# Altium schematic sheet StuctureReceiver.SchDoc: Структурна схема передавача аудіосигналів
size A2; Author: Neuimin; CompanyName: KPI; Organization: KPI; Address3: Kyiv; Address4: Ukraine
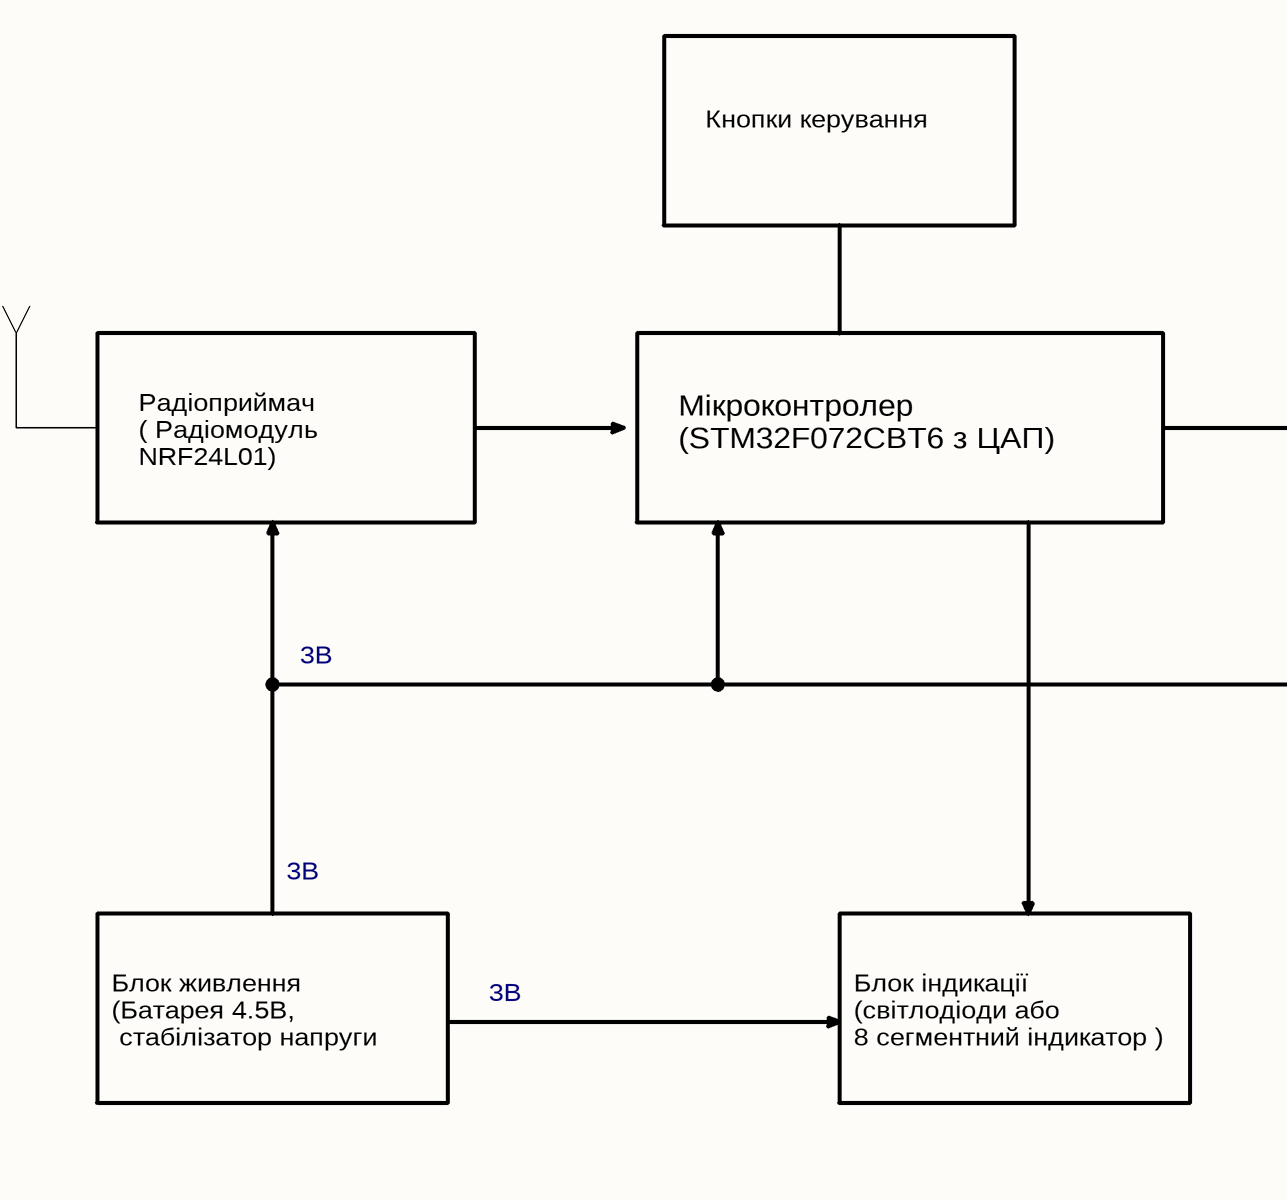
[diagram p0: StuctureReceiver.SchDoc, left]
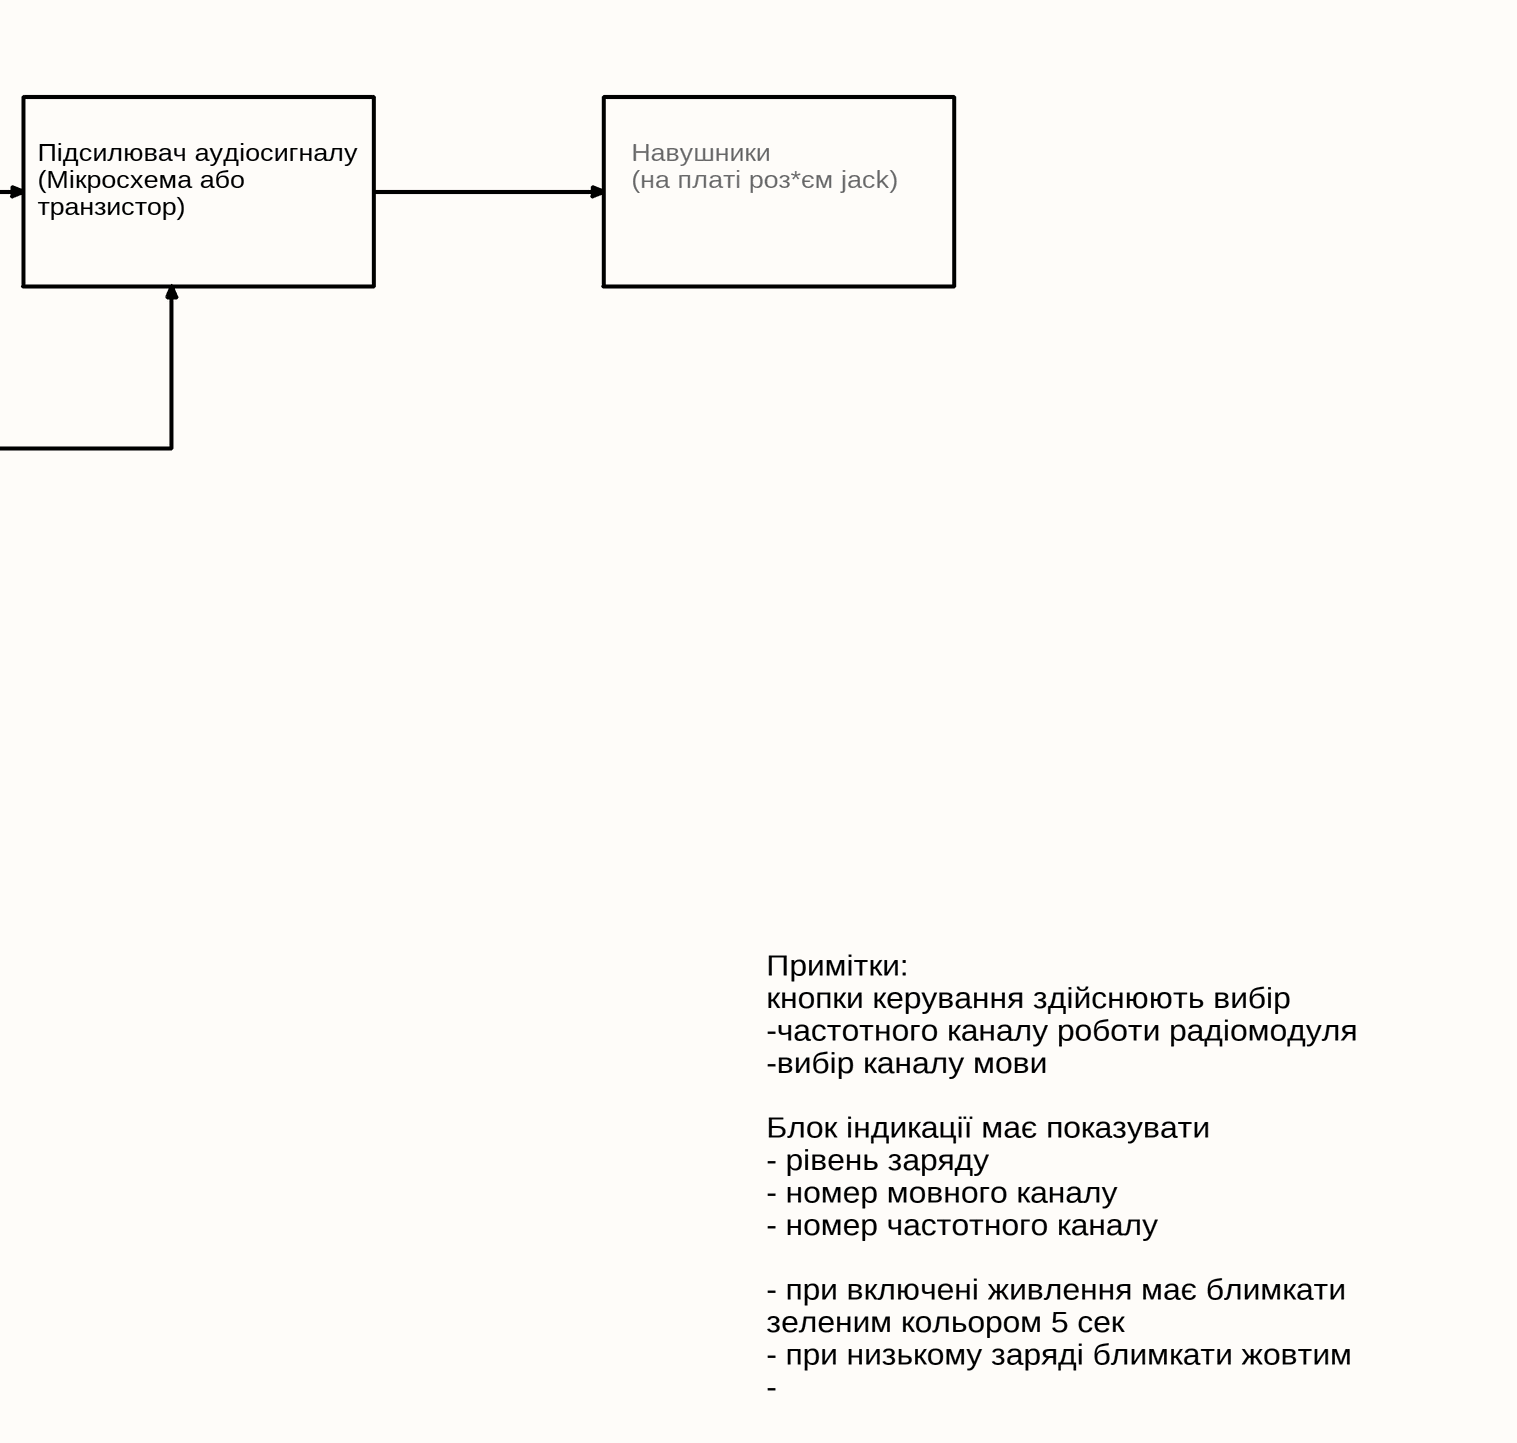
[diagram p1: StuctureReceiver.SchDoc, right]

## Notes on the sheet
- Кнопки керування
- Радіоприймач
  ( Радіомодуль NRF24L01)
- Мікроконтролер
  (STM32F072CBT6 з ЦАП)
- Підсилювач аудіосигналу
  (Mікросхема або транзистор)
- Навушники
  (на платі роз*єм jack)
- 3В
- Блок живлення
  (Батарея 4.5В,
  стабілізатор напруги 3.3В )
- Блок індикації
  (світлодіоди або
  8 сегментний індикатор )
- Примітки:
  кнопки керування здійснюють вибір
  -частотного каналу роботи радіомодуля
  -вибір каналу мови
  Блок індикації має показувати
  - рівень заряду
  - номер мовного каналу
  - номер частотного каналу
  - при включені живлення має блимкати зеленим кольором 5 сек
  - при низькому заряді блимкати жовтим
  -
- Title
- Size:
- Date:
- File:
- A2
- Number:
- Time:
- Revision:
- Sheet
- of